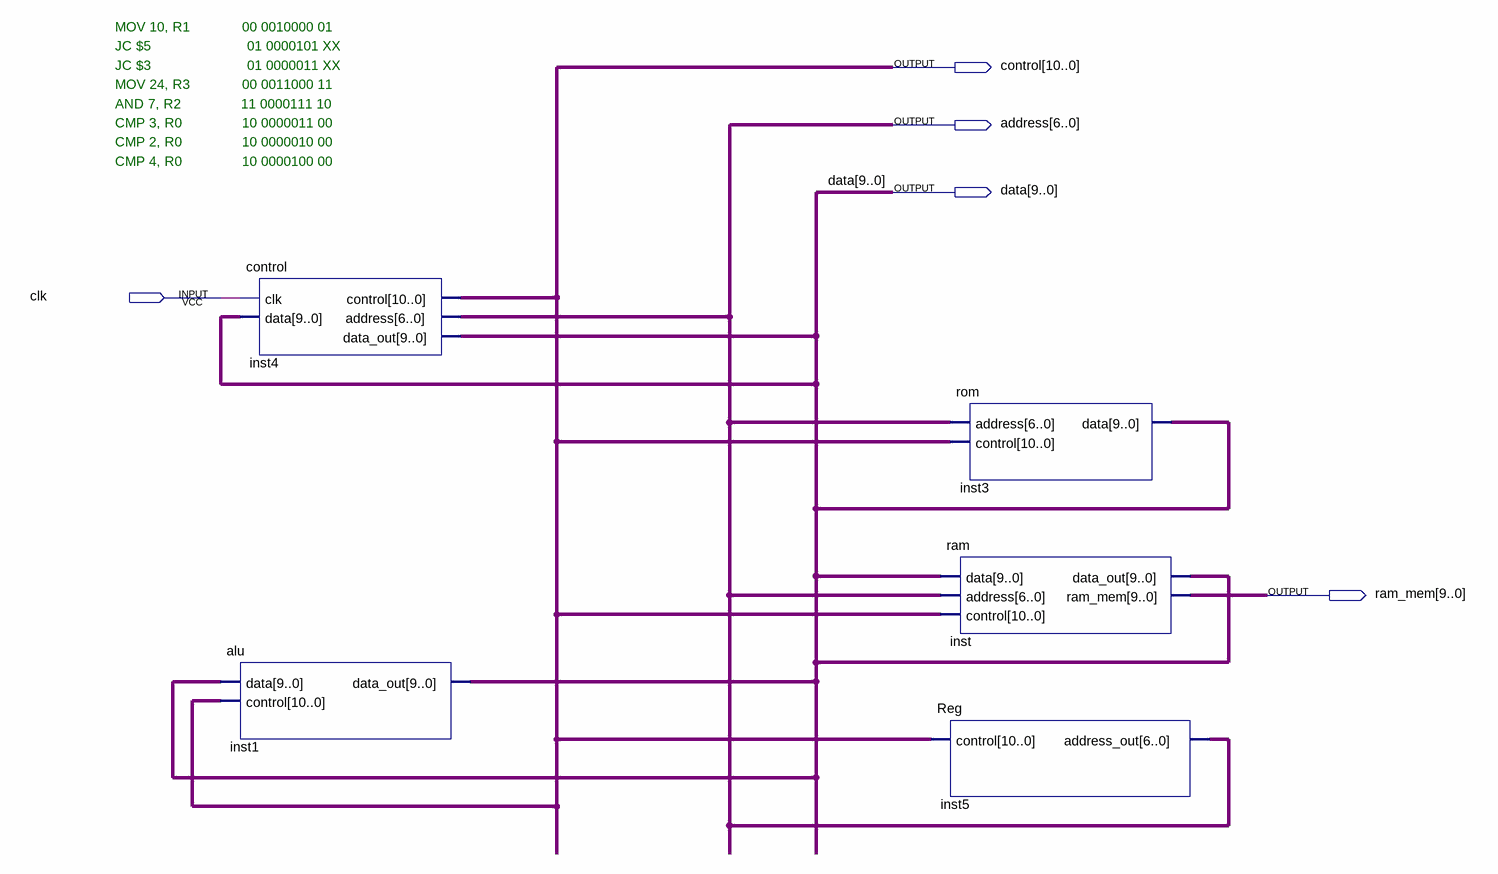
[diagram p0: schematic sheet]
// Quartus schematic lab_4.bdf as structural Verilog: 5 symbols, 5 pins
module lab_4 (
  input  clk,
  output [10:0] control,
  output [6:0] address,
  output [9:0] data,
  output [9:0] ram_mem
);

  control inst4 (.clk(clk), .data(data), .control(control), .address(address), .data_out(data));
  alu inst1 (.data(data), .control(control), .data_out(data));
  rom inst3 (.address(address), .control(control), .data(data));
  ram inst (.data(data), .address(address), .control(control), .data_out(data), .ram_mem(ram_mem));
  Reg inst5 (.control(control), .address_out(address));

  // Notes on the sheet:
  //   MOV 10, R1             00 0010000 01
  //   JC $5                        01 0000101 XX
  //   JC $3                        01 0000011 XX
  //   MOV 24, R3             00 0011000 11
  //   AND 7, R2               11 0000111 10
  //   CMP 3, R0               10 0000011 00
  //   CMP 2, R0               10 0000010 00
  //   CMP 4, R0               10 0000100 00
endmodule
